# Altium schematic sheet EtherCATConnectors.SchDoc
size 420 x 297 mm; SheetNumber: 10; SheetTotal: 10; PageSetup: Record=PageOptions|CenterHorizontal=True|CenterVertical=True|PrintScale=0.96|XCorrection=1.00|YCorrection=1.00|PrintKind=1|BorderSize=5000000|LeftOffset=0|BottomOffset=0|Orientation=2|PaperLength=4318|PaperWidth=2794|Scale=100|PaperSource=7|PrintQuality=600|MediaType=1|DitherType=10|PaperKind=11" x 17"|PrintScaleMode=1
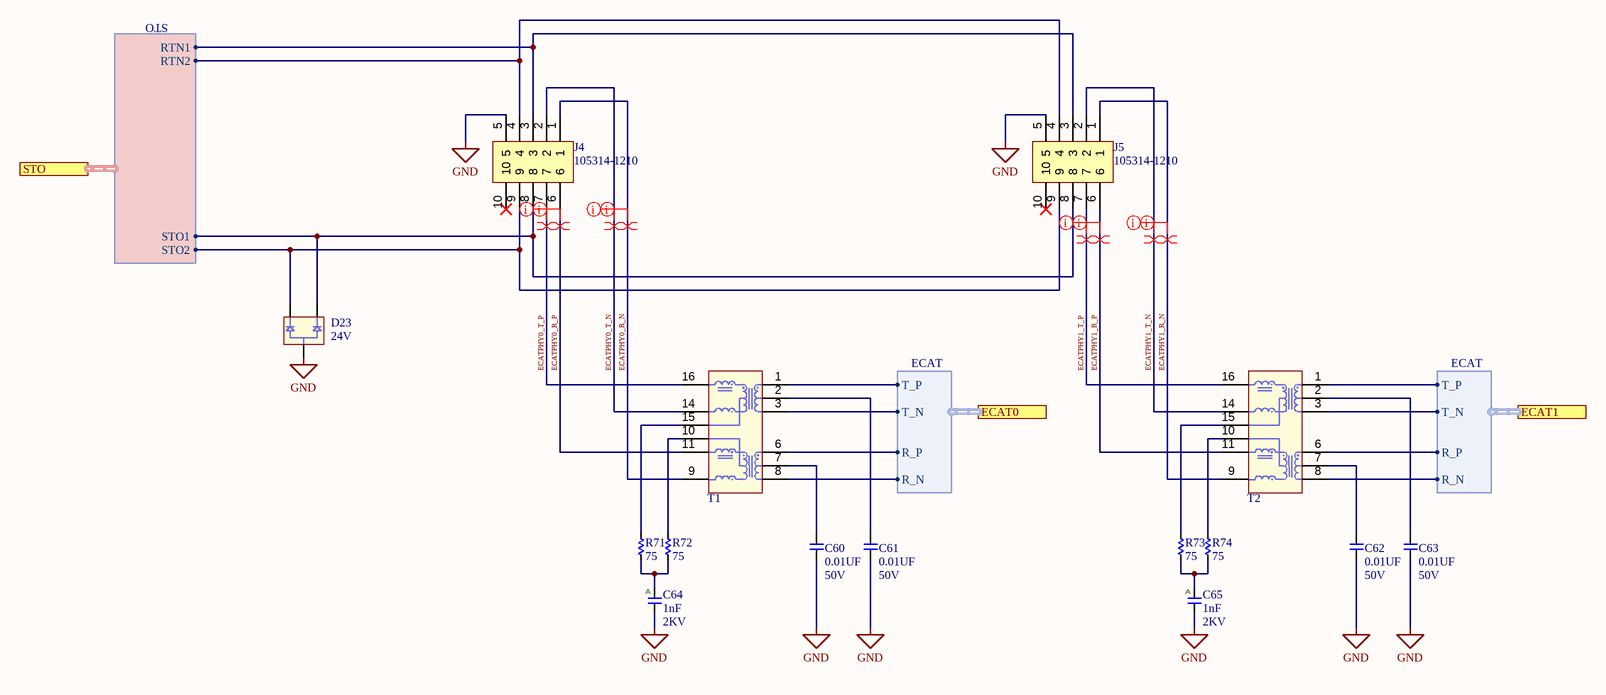
[diagram p0: EtherCATConnectors.SchDoc]

## Parts
C60  value 0.01UF  Voltage: 50V  [C0402]  (hidden comment: __Template_Cap)
C61  value 0.01UF  Voltage: 50V  [C0402]  (hidden comment: __Template_Cap)
C62  value 0.01UF  Voltage: 50V  [C0402]  (hidden comment: __Template_Cap)
C63  value 0.01UF  Voltage: 50V  [C0402]  (hidden comment: __Template_Cap)
C64  value 1nF  Voltage: 2KV  [C1210]  (hidden comment: __Template_Cap_Auto)
C65  value 1nF  Voltage: 2KV  [C1210]  (hidden comment: __Template_Cap_Auto)
D23  24V  [3SOT23]
J4  Manufacturer Part Number: 105314-1210  [MOLEX_1053141210]  (hidden comment: MOLEX_2X5_NANOFIT_1053141210)
J5  Manufacturer Part Number: 105314-1210  [MOLEX_1053141210]  (hidden comment: MOLEX_2X5_NANOFIT_1053141210)
R71  value 75  [R0402]
R72  value 75  [R0402]
R73  value 75  [R0402]
R74  value 75  [R0402]
T1  PULSE_H1102NL  [PULSE_HXXXX]  (value not drawn)
T2  PULSE_H1102NL  [PULSE_HXXXX]  (value not drawn)

## Ports
ECAT0 (harness ECAT), ECAT1 (harness ECAT), STO (harness STO)

## Harnesses
ECAT: R_P, R_N, T_P, T_N
STO: STO1, RTN2, STO2, RTN1

## Nets
GND: C60.2 C61.2 C62.2 C63.2 C64.2 C65.2 D23.3 J4.5 J5.5
ECATPHY0_R_N: J4.1 T1.9
ECATPHY0_R_P: J4.6 T1.11
ECATPHY0_T_N: J4.2 T1.14
ECATPHY0_T_P: J4.7 T1.16
ECATPHY1_R_N: J5.1 T2.9
ECATPHY1_R_P: J5.6 T2.11
ECATPHY1_T_N: J5.2 T2.14
ECATPHY1_T_P: J5.7 T2.16
NetC60_1: C60.1 T1.7
NetC61_1: C61.1 T1.2
NetC62_1: C62.1 T2.7
NetC63_1: C63.1 T2.2
NetC64_1: C64.1 R71.1 R72.1
NetC65_1: C65.1 R73.1 R74.1
NetD23_1: D23.1 J4.8 J5.8 ; port STO.STO1
NetD23_2: D23.2 J4.9 J5.9 ; port STO.STO2
NetJ4_3: J4.3 J5.3 ; port STO.RTN1
NetJ4_4: J4.4 J5.4 ; port STO.RTN2
NetR71_2: R71.2 T1.15
NetR72_2: R72.2 T1.10
NetR73_2: R73.2 T2.15
NetR74_2: R74.2 T2.10
NetT1_1: T1.1 ; port ECAT0.T_P
NetT1_3: T1.3 ; port ECAT0.T_N
NetT1_6: T1.6 ; port ECAT0.R_P
NetT1_8: T1.8 ; port ECAT0.R_N
NetT2_1: T2.1 ; port ECAT1.T_P
NetT2_3: T2.3 ; port ECAT1.T_N
NetT2_6: T2.6 ; port ECAT1.R_P
NetT2_8: T2.8 ; port ECAT1.R_N

Not connected (* = marked no-connect by the designer): J4 10*; J5 10*

## Layout directives
differential pair; differential pair class 100Ohm: ECATPHY0_R_N, ECATPHY0_R_P, ECATPHY0_T_N, ECATPHY0_T_P, ECATPHY1_R_N, ECATPHY1_R_P, ECATPHY1_T_N, ECATPHY1_T_P
net class Diff100Ohm: ECATPHY0_R_N, ECATPHY0_R_P, ECATPHY0_T_N, ECATPHY0_T_P, ECATPHY1_R_N, ECATPHY1_R_P, ECATPHY1_T_N, ECATPHY1_T_P

## Notes on the sheet
- CREATIVE COMMONS
- PUBLIC LICENSE:
- BARKOUR ROBOT
- CC BY-NC 4.0
- APPROVED
- DWG NO
- GOOGLE LLC
- FILE
- RELEASED
- 2024/05/09
- SIZE
- 1600 AMPHITHEATRE PARKWAY
- MOUNTAIN VIEW CA 94043
- A3
- SHEET
- OF
- THIS DESIGN IS BEING PROVIDED  FOR NON-COMMERCIAL USE ONLY. THE USE OF =SCIENTIST_NAME_POSSESSIVE NAME IN CONNECTION WITH THE DESIGN IS NOT INTENDED TO IMPLY THAT =SCIENTIST_NAME SPONSORS OR ENDORSES THE DESIGN, GOOGLE LLC, OR ANY OF GOOGLE LLC'S PRODUCTS OR SERVICES.
- (in symbol 6) A

## Library data of the parts
C60-C63 = 625: CAP, CER, X7R, 0.01uF, 50V, 20%, 0402, 0.56mm T; ID: 625; MFG: KEMET; MFG P/N: C0402C103M5RACTU; XPN: 150-00227-00; EES: 150-04592-00; Status: Released; Package: 0402; Dielectric: X7R; Tolerance: 20%; Height: 0.56mm T; ComponentLink1Description: Datasheet; COMMON: 150-00227-00; LOON: 150-00227-00; Gecko: 150-00227-00
C64 C65 = 6: CAP, CER, X7S, 1000PF, 2KV, 10%, 1210; ID: 6; MFG: TDK; MFG P/N: CGA6M1X7S3D102K200AA; XPN: XS-10001044; COMMON: 150-01098-00; PROXY: 150-04677-00; Status: Released; Package: 1210; Dielectric: X7S; Tolerance: 10%; Height: 2.20mm; Supplier 1: Digi-Key; ComponentLink1Description: Datasheet; Supplier Part Number 1: 445-13038-1-ND
D23 = 176: DIODE, TVS, UNIDIR, DUAL, 24VRWM, 26VBR, 41VCL, SOT-23-3; ID: 176; MFG: Infineon Technologies; MFG P/N: ESD24VS2UE6327HTSA1; Value: ESD24VS2UE6327HTSA1; LOON: 480-01202-00; Gecko: 480-01676-00; Voltage - Clamping (Max) @ Ipp: 41V; Status: Released; Package: TO-236-3, SC-59, SOT-23-3; Category: Diode; RoHS Compliant: Yes; Diode Type: TVS; Mounting Type: SMD; Voltage - DC Reverse (VR) (MAX): 24V; Operating Temperature – Junction: -55°C ~ 150°C (TJ); Supplier 1: Digi-Key; HelpURL: https://www.digikey.in/product-detail/en/infineon-technologies/ESD24VS2UE6327HTSA1/ESD24VS2UE6327HTSA1CT-ND/1785650; ComponentLink1Description: Datasheet; ComponentLink1URL: https://www.infineon.com/dgdl/Infineon-ESD24VS2U-DS-v01_01-en.pdf?fileId=db3a3043340fff53013413a2249d2ff3; Supplier Part Number 1: ESD24VS2UE6327HTSA1CT-ND
J4 J5 = MOLEX_2X5_NANOFIT_1053141210: Conn HDR 10 POS 2.5mm Solder RA Thru-Hole 10 Terminal 1 Port; Manufacturer: Molex; Connector Type: Header,Male Pin; Number of Positions: 10; Supplier 1: Digi-Key; Supplier Part Number 1: WM15162-ND; RoHS: Yes; Category: Headers and Wire Housings; Stock 1: 2469; Pricing 1: 1=2.84000, 10=2.49900, 120=1.98792, 960=1.64713, 4920=1.47673 (USD); Mount: Through Hole; Contact Plating: Gold; Contact Material: Brass; Contact Shape: Square; Insulation Material: Polymer; Insulation Color: Black; Min Operating Temperature: -40°C; Max Operating Temperature: 105°C; Fastening Type: Latch; Packaging: Tray; Number of Rows: 2; Termination: Solder; RoHS Compliant: Yes; ComponentLink1URL: https://www.molex.com/pdm_docs/ps/PS-105300-100-001.pdf?src-supplier=Digi-Key; ComponentLink1Description: https://www.molex.com/pdm_docs/ps/PS-105300-100-001.pdf?src-supplier=Digi-Key
R71-R74 = 2283: RES, 75, 1%, 1/16W, 0402; ID: 2283; MFG: YAGEO; MFG P/N: RC0402FR-0775RL; COMMON: 470-00607-00; PROXY: 470-10028-00; KOI: 470-17279-00; Status: Released; Package: 0402; Power: 1/16W; Tolerance: 1%; Height: 0.40mm; Supplier 1: Digi-Key; XPN: 470-00607-00; Supplier Part Number 1: 311-75.0LRCT-ND
T1 T2 = PULSE_H1102NL: Telecom Transformer 2(1:1) 0.65Ohm Prim. DCR 0.65Ohm Sec. DCR 16 Terminal Gull Wing SMD; Manufacturer: Pulse; Shielding: Unshielded; Isolation Voltage: 1.5kV; Insertion Loss: -1.1dB; Return Loss: -11.5dB; DC Resistance (DCR): 650mR; Supplier 1: Digi-Key; Supplier Part Number 1: 553-1323-5-ND; Manufacturer Part Number: H1102NL; RoHS: Yes; Category: Transformers; Stock 1: 978; Pricing 1: 1=5.63000, 10=4.55900, 25=3.68600, 50=3.45320, 100=3.29800, 250=3.20100, 500=3.10400, 1000=3.00700 (USD); Mount: Surface Mount; Case/Package: Module; Number of Pins: 16; Weight: 0.098767oz; Min Operating Temperature: 0°C; Max Operating Temperature: 70°C; Turns Ratio: 1:1; Lead/Base Style: Gull Wing; Packaging: Rail/Tube; Package Quantity: 40; Termination: SMD/SMT; Series: -; Length: 12.7mm; Width: 9.53m; Height: 6.09mm; Height - Seated (Max): 6.22mm; Depth: 9.53mm; Radiation Hardening: No; RoHS Compliant: Yes; Lead Free: Lead Free; ComponentLink1URL: https://datasheet.ciiva.com/2938/10-100base-tsingleportsmdmagnetics-rev2008-2938779.pdf?src-supplier=Digi-Key; ComponentLink1Description: https://datasheet.ciiva.com/2938/10-100base-tsingleportsmdmagnetics-rev2008-2938779.pdf?src-supplier=Digi-Key